# EAGLE design disp_adapter (EAGLE 5.09)
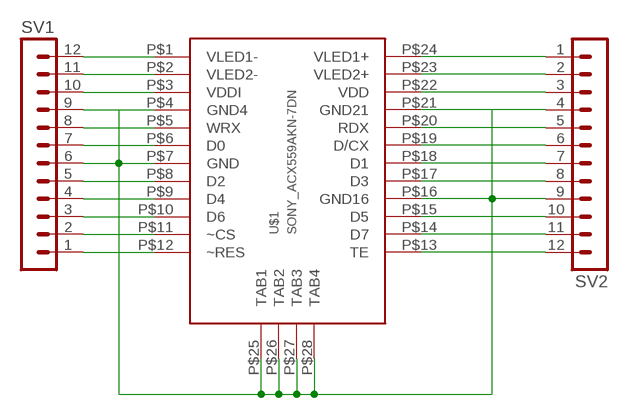
[diagram p0: schematic, sheet 1]

## Parts
SV1  MA12-1  [MA12-1]
SV2  MA12-1  [MA12-1]
U$1  SONY_ACX559AKN-7DN  [SONY_ACX559AKN-7_A]

## Nets
N$1: SV1.1 U$1.P$12(~RES)
N$2: SV1.2 U$1.P$11(~CS)
N$3: SV1.3 U$1.P$10(D6)
N$4: SV1.4 U$1.P$9(D4)
N$5: SV1.5 U$1.P$8(D2)
N$7: SV1.7 U$1.P$6(D0)
N$8: SV1.8 U$1.P$5(WRX)
N$10: SV1.10 U$1.P$3(VDDI)
N$11: SV1.11 U$1.P$2(VLED2-)
N$12: SV1.12 U$1.P$1(VLED1-)
N$13: SV2.1 U$1.P$24(VLED1+)
N$14: SV2.2 U$1.P$23(VLED2+)
N$15: SV2.3 U$1.P$22(VDD)
N$17: SV2.5 U$1.P$20(RDX)
N$18: SV2.6 U$1.P$19(D/CX)
N$19: SV2.7 U$1.P$18(D1)
N$20: SV2.8 U$1.P$17(D3)
N$21: SV1.6 SV1.9 SV2.4 SV2.9 U$1.P$4(GND4) U$1.P$7(GND) U$1.P$16(GND16) U$1.P$21(GND21) U$1.P$25(TAB1) U$1.P$26(TAB2) U$1.P$27(TAB3) U$1.P$28(TAB4)
N$22: SV2.10 U$1.P$15(D5)
N$23: SV2.11 U$1.P$14(D7)
N$24: SV2.12 U$1.P$13(TE)

## Library data of the parts
SV1 SV2 = con-lstb:MA12-1: PIN HEADER
U$1 = Fabian:SONY_ACX559AKN-7: SONY ACX559AKN-7 full Color display matching connector JST-JAN 24R-JANK-GSAN-TF

## Net classes
0 default: width 0.2 mm

## Board
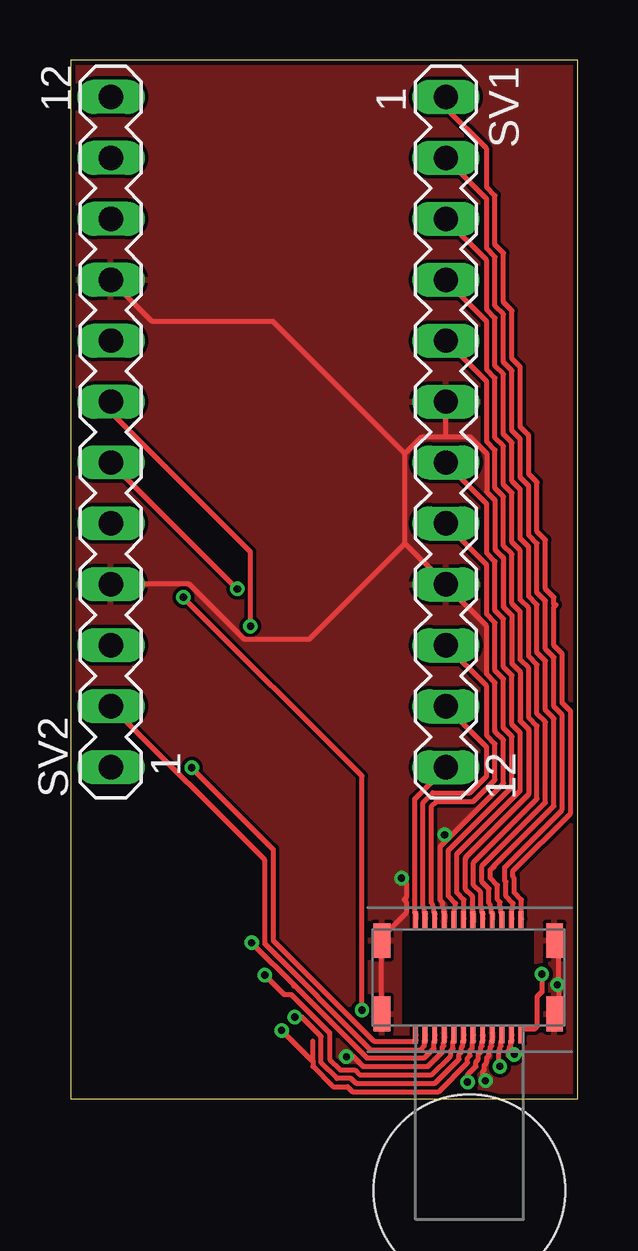
[diagram p1: board, top side]
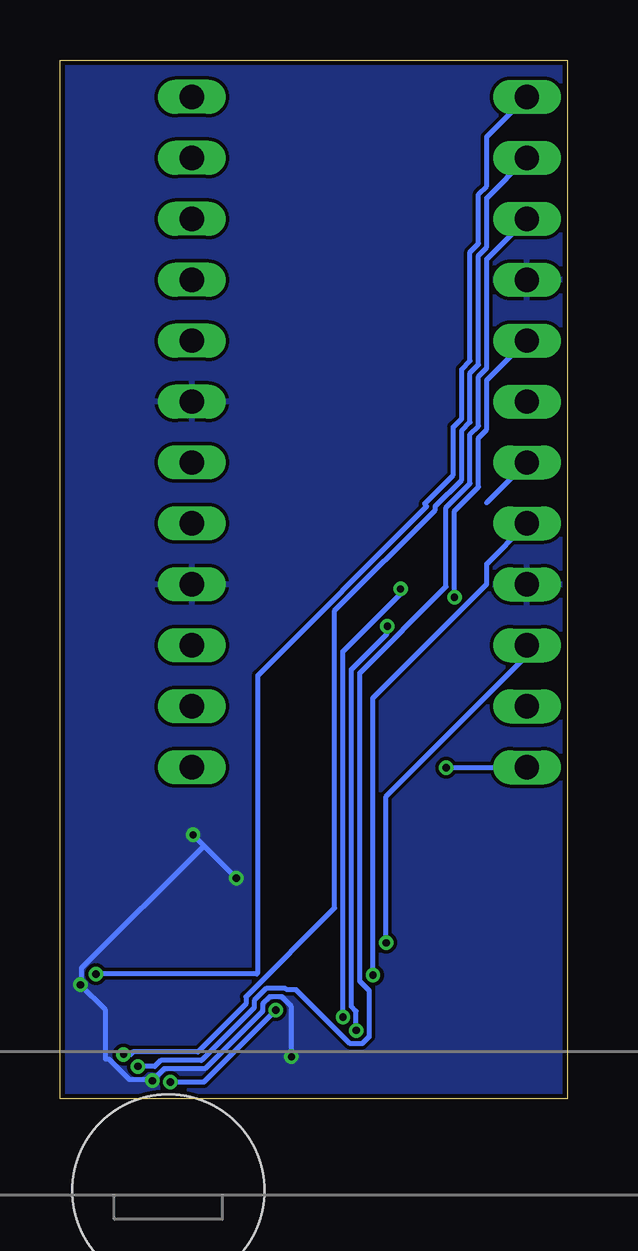
[diagram p2: board, bottom side, seen from below]

Size 21.15 x 43.3 mm. Coordinates in mm from the lower left corner, seen from the top.
Outline: 0,0 21.15,0 21.15,43.3 0,43.3 0,0
Copper layers (1*16): Top 0.035mm / dielectric 1.5mm / Bottom 0.035mm
Design rules "Fischer-LP": minimum track width 0.15mm, minimum drill 0.3mm, track to track 0.15mm, track to pad 0.15mm, pad to pad 0.15mm, via to via 0.15mm, smd to smd 0mil, copper to edge 0.2mm, drill to drill 0.3mm, minimum pad ring 0.2mm, minimum via ring 0.15mm, stop-mask expansion 0.15mm, vias tented up to drill 0.5mm, thermal gap 0.15mm

### Footprints (pad centres in the part's own frame; a part is rotated, then mirrored left to right if it is on the bottom)
MA12-1 = drill 1.016 long: 1 -13.97,0; 2 -11.43,0; 3 -8.89,0; 4 -6.35,0; 5 -3.81,0; 6 -1.27,0; 7 1.27,0; 8 3.81,0; 9 6.35,0; 10 8.89,0; 11 11.43,0; 12 13.97,0
SONY_ACX559AKN-7_A = smd 0.2 x 0.7: P$1 0,0; P$2 0.4,0; P$3 0.8,0; P$4 1.2,0; P$5 1.6,0; P$6 2,0; P$7 2.4,0; P$8 2.8,0; P$9 3.2,0; P$10 3.6,0; P$11 4,0; P$12 4.4,0; P$13 4.4,-4.8; P$14 4,-4.8; P$15 3.6,-4.8; P$16 3.2,-4.8; P$17 2.8,-4.8; P$18 2.4,-4.8; P$19 2,-4.8; P$20 1.6,-4.8; P$21 1.2,-4.8; P$22 0.8,-4.8; P$23 0.4,-4.8; P$24 0,-4.8 | smd 0.7 x 1.45: P$25 5.8,-0.875; P$26 5.8,-3.925; P$27 -1.4,-3.925; P$28 -1.4,-0.875 | hole 8: 2.25,-11.3

### Placement (x,y rotation side)
SV1  15.65,27.79 270 top
SV2  1.68,27.79 90 top
U$1  14.38,7.47 0 top

### Tracks (layer width: path | path; a pad name or v marks a point on that pad's centre or on a via)
N$1
  Top 0.2: U$1.P$12 18.8,7.5 18.8,8.3 18.5,8.6 18.5,9.2 18.45,9.25 18.45,9.5 20.85,11.9 20.85,16.15 20.5,16.5 20.5,18.55 20.15,18.9 20.15,20.5 20.2,20.55 | 20.2,20.55 20.25,20.6 | 20.2,20.55 20.15,20.6 20.15,20.9 19.8,21.25 19.8,23.3 19.45,23.65 19.45,25.7 19.1,26.05 19.1,27.65 18.75,28 18.75,30.5 18.4,30.85 18.4,32.85 18.05,33.2 18.05,35.25 17.7,35.6 17.7,37.65 17.35,38 17.35,39.6 15.65,41.3 SV1.1
N$2
  Top 0.2: U$1.P$11 18.4,7.5 18.4,7.9 18.45,7.95 18.45,8.15 18.15,8.45 18.15,9.05 18.1,9.1 18.1,9.65 20.5,12.05 20.5,16 20.15,16.35 20.15,18.4 19.8,18.75 19.8,20.75 19.45,21.1 19.45,23.15 19.1,23.5 19.1,25.55 18.75,25.9 18.75,27.5 18.4,27.85 18.4,30.35 18.05,30.7 18.05,32.7 17.7,33.05 17.7,35.1 17.35,35.45 17.35,37.5 15.65,39.2 SV1.2
N$3
  Top 0.2: U$1.P$10 18,7.5 18,7.7 17.95,7.75 17.95,7.95 17.9,8 17.9,8.2 17.8,8.3 17.8,8.9 17.5,9.2 17.5,9.55 17.6,9.65 17.65,9.65 17.65,9.7 20.15,12.2 20.15,15.85 19.8,16.2 19.8,18.25 19.45,18.6 19.45,20.6 19.1,20.95 19.1,23 18.75,23.35 18.75,25.4 18.4,25.75 18.4,27.35 18.05,27.7 18.05,30.2 17.7,30.55 17.7,32.55 17.35,32.9 17.35,34.95 15.65,36.65 SV1.3
N$4
  Top 0.2: U$1.P$9 17.6,7.5 17.6,7.7 17.55,7.75 17.55,7.95 17.5,8 17.5,8.1 17.45,8.15 17.45,8.75 17.15,9.05 17.15,9.7 19.8,12.35 19.8,15.7 19.45,16.05 19.45,18.1 19.1,18.45 19.1,20.45 18.75,20.8 18.75,22.85 18.4,23.2 18.4,25.25 18.05,25.6 18.05,27.2 17.7,27.55 17.7,30.05 17.35,30.4 17.35,32.4 15.65,34.1 SV1.4
N$5
  Top 0.2: U$1.P$8 17.2,7.5 17.2,7.7 17.15,7.75 17.15,7.95 17.1,8 17.1,8.6 16.8,8.9 16.8,9.85 19.45,12.5 19.45,15.55 19.1,15.9 19.1,17.95 18.75,18.3 18.75,20.3 18.4,20.65 18.4,22.7 18.05,23.05 18.05,25.1 17.7,25.45 17.7,27.05 17.35,27.4 17.35,29.9 SV1.5
N$7
  Top 0.2: U$1.P$6 16.4,7.5 16.4,8.3 16.1,8.6 16.1,10.2 18.75,12.85 18.75,15.25 18.4,15.6 18.4,17.65 18.05,18 18.05,20 17.7,20.35 17.7,22.4 17.35,22.75 17.35,24.8 15.65,26.5 SV1.7
N$8
  Top 0.2: U$1.P$5 16,7.5 16,7.9 16.05,7.95 16.05,8.15 15.75,8.45 15.75,10.35 18.4,13 18.4,15.1 18.05,15.45 18.05,17.5 17.7,17.85 17.7,19.85 17.35,20.2 17.35,22.25 15.65,23.95 SV1.8
N$10
  Top 0.2: U$1.P$3 15.2,7.5 15.2,7.7 15.15,7.75 15.15,7.95 15.1,8 15.1,8.1 15.05,8.15 15.05,12.2 15.25,12.4 16.8,12.4 17.7,13.3 17.7,14.8 17.35,15.15 17.35,17.2 SV1.10
N$11
  Top 0.2: U$1.P$2 14.8,7.5 14.8,7.7 14.75,7.75 14.75,7.95 14.7,8 14.7,12.35 15.1,12.75 16.65,12.75 17.35,13.45 17.35,14.65 SV1.11
N$12
  Top 0.2: U$1.P$1 14.4,7.5 14.4,7.7 14.35,7.75 14.35,12.5 15.65,13.8 SV1.12
N$13  (via drill 0.3)
  Top 0.2: U$1.P$24 14.4,2.65 14.4,2.45 14.35,2.4 12.65,2.4 8.45,6.6 8.45,10.4 v5.05,13.8
  Bottom 0.2: v5.05,13.8 1.7,13.8 SV2.1
N$14
  Top 0.2: U$1.P$23 14.8,2.65 14.8,2.45 14.75,2.4 14.75,2.2 14.6,2.05 12.5,2.05 8.1,6.45 8.1,9.95 1.7,16.35 SV2.2
N$15  (via drill 0.3)
  Top 0.2: 9.35,4.7 9.3,4.7 | 9.35,4.7 12.35,1.7 14.75,1.7 15.15,2.1 15.15,2.4 15.2,2.45 15.2,2.65 U$1.P$22 | v7.55,6.5 9.35,4.7
  Bottom 0.2: v7.55,6.5 7.55,12.6 1.7,18.45 1.7,18.9 SV2.3
N$17  (via drill 0.3)
  Top 0.2: U$1.P$20 16,2.65 16,2.45 15.95,2.4 15.95,2.1 15.85,2 15.85,1.8 15.05,1 12.05,1 11.85,1.2 11.25,1.2 10.8,1.65 10.8,2.75 9.2,4.35 8.9,4.35 v8.1,5.15
  Bottom 0.2: v8.1,5.15 8.1,16.7 3.35,21.45 3.35,22.3 1.7,23.95 SV2.5
N$18  (via drill 0.3)
  Top 0.2: U$1.P$19 16.4,2.65 16.4,2.45 16.35,2.4 16.35,2.2 16.3,2.15 16.3,1.95 16.2,1.85 16.2,1.65 15.2,0.65 11.9,0.65 11.7,0.85 11.1,0.85 10.45,1.5 10.45,2.6 9.65,3.4 v9.35,3.4 | v6.95,21.25 SV2.6
  Bottom 0.2: SV2.6 3.35,24.85 | v6.95,21.25 6.95,21.05 9.35,18.65 v9.35,3.4
N$19  (via drill 0.3)
  Top 0.2: 10.1,1.6 10.1,1.35 10.95,0.5 11.55,0.5 11.75,0.3 15.35,0.3 16.55,1.5 16.55,1.7 16.65,1.8 16.65,2 16.75,2.1 16.75,2.35 16.8,2.4 16.8,2.65 U$1.P$18 | 10.1,1.6 10.1,2.4 | v7.5,19.7 7.5,22.8 1.7,28.6 1.7,29.05 SV2.7 | v8.8,2.85 10.05,1.6 10.1,1.6
  Bottom 0.2: v7.5,19.7 7.5,19.4 9,17.9 9,3.85 8.8,3.65 v8.8,2.85
N$20  (via drill 0.3)
  Top 0.2: 17.2,2.65 U$1.P$17 17.2,2.6 17.2,2.45 17.15,2.4 17.15,2.2 17.1,2.15 17.1,1.95 17,1.85 17,1.65 16.9,1.55 16.9,1.35 16.55,1 v16.55,0.7 16.55,0.55 | v12.15,3.7 12.15,13.45 v4.7,20.9
  Bottom 0.2: v16.55,0.7 15.15,0.7 v12.15,3.7 | SV2.8 1.7,31.6 3.35,29.95 3.35,27.9 3.7,27.55 3.7,25.5 4.7,24.5 v4.7,20.9
N$21  (via drill 0.3)
  Top 0.2: U$1.P$27 12.95,3.6 12.95,6.45 U$1.P$28 13,6.65 13,6.75 14,7.75 14,8.2 13.9,8.3 14,8.4 14,9 v13.8,9.2 | 15.75,10.85 18.05,13.15 18.05,14.95 17.7,15.3 17.7,17.35 17.35,17.7 17.35,19.7 15.65,21.4 SV1.9 15.6,21.5 13.95,23.15 | 15.75,10.85 15.4,10.5 15.4,8.3 15.5,8.2 15.5,8 15.55,7.95 15.55,7.75 15.6,7.7 15.6,7.5 U$1.P$4 | U$1.P$7 16.8,7.5 16.8,7.7 16.75,7.75 16.75,8.45 16.45,8.75 16.45,10 16.5,10.05 16.5,10.1 19.1,12.7 19.1,15.4 18.75,15.75 18.75,17.8 18.4,18.15 18.4,20.15 18.05,20.5 18.05,22.55 17.7,22.9 17.7,24.95 17.35,25.3 17.35,26.9 16.65,27.6 15.65,27.6 | 15.65,27.6 14.65,27.6 13.95,26.9 | 13.95,23.15 13.95,26.9 | v15.6,11 15.75,10.85 | U$1.P$25 20.2,6.55 20.2,6.35 20.35,6.2 20.35,4.75 | 20.35,4.75 20.35,3.9 20.2,3.75 20.2,3.55 U$1.P$26 | 17.6,2.65 U$1.P$16 17.6,2.6 17.6,2.45 17.55,2.4 17.55,2.2 17.5,2.15 17.5,2.05 17.45,2 17.45,1.8 17.35,1.7 17.35,1.5 17.25,1.4 17.25,1.2 17.2,1.15 17.2,0.65 v17.3,0.75 | v11.5,1.75 11.8,1.75 12.2,1.35 14.9,1.35 15.5,1.95 15.5,2.15 15.55,2.2 15.55,2.35 15.6,2.4 15.6,2.65 U$1.P$21 | v20.3,4.75 20.35,4.75 | 1.7,21.45 SV2.4 1.8,21.45 4.95,21.45 7.25,19.15 9.95,19.15 13.95,23.15 | 15.65,27.6 SV1.6 | SV2.9 1.7,34.1 3.4,32.4 8.45,32.4 13.95,26.9
  Bottom 0.2: 15.15,10.55 v13.8,9.2 | 15.15,10.55 v15.6,11 | v11.5,1.75 11.5,3.85 11.9,4.25 12.4,4.25 12.7,3.95 12.7,3.65 15.1,1.25 16.8,1.25 v17.3,0.75 17.35,0.8 18.25,0.8 19.1,1.65 19.25,1.65 19.25,3.7 v20.3,4.75 20.25,4.8 20.25,5.45 15.15,10.55
  pour Top: -0.05,43.25 21,43.25 21,0.05 0,0.05
  pour Bottom: 0.05,43.25 20.9,43.25 20.9,0 0,0 0,42.85
N$22  (via drill 0.3)
  Top 0.2: U$1.P$15 18,2.65 18,2.45 17.95,2.4 17.95,2.2 17.9,2.15 17.9,2.05 17.85,2 17.85,1.35 v17.9,1.35
  Bottom 0.2: v17.9,1.35 17.2,1.35 16.95,1.6 15.25,1.6 13.05,3.8 13.05,4.1 12.55,4.6 11.75,4.6 11.7,4.55 11.3,4.55 9.05,2.3 8.55,2.3 8.25,2.6 8.25,4.5 8.65,4.9 8.65,17.75 5.05,21.35 5.05,24.65 4.05,25.65 4.05,27.7 3.7,28.05 3.7,30.1 3.35,30.45 3.35,35 1.7,36.65 SV2.10
N$23  (via drill 0.3)
  Top 0.2: U$1.P$14 18.4,2.65 18.4,2.45 18.35,2.4 18.35,2.2 18.3,2.15 18.3,2.05 18.25,2 18.25,1.8 18.45,1.8 v18.5,1.85
  Bottom 0.2: v18.5,1.85 18.2,1.85 18.1,1.95 15.4,1.95 13.4,3.95 13.4,4.25 9.7,7.95 9.7,20.35 5.5,24.55 5.5,24.7 4.4,25.8 4.4,27.85 4.05,28.2 4.05,30.25 3.7,30.6 3.7,35.15 3.35,35.5 3.35,37.55 SV2.11
N$24  (via drill 0.3)
  Top 0.2: v19.65,5.2 19.65,4.45 19.45,4.25 19.45,3 19.35,2.9 18.85,2.9 18.8,2.85 18.8,2.7 U$1.P$13
  Bottom 0.2: SV2.12 1.7,41.75 3.35,40.1 3.35,38.05 3.7,37.7 3.7,35.65 4.05,35.3 4.05,30.75 4.4,30.4 4.4,28.35 4.75,28 4.75,26 5.95,24.8 5.85,24.7 12.9,17.65 12.9,5.25 12.95,5.2 v19.65,5.2